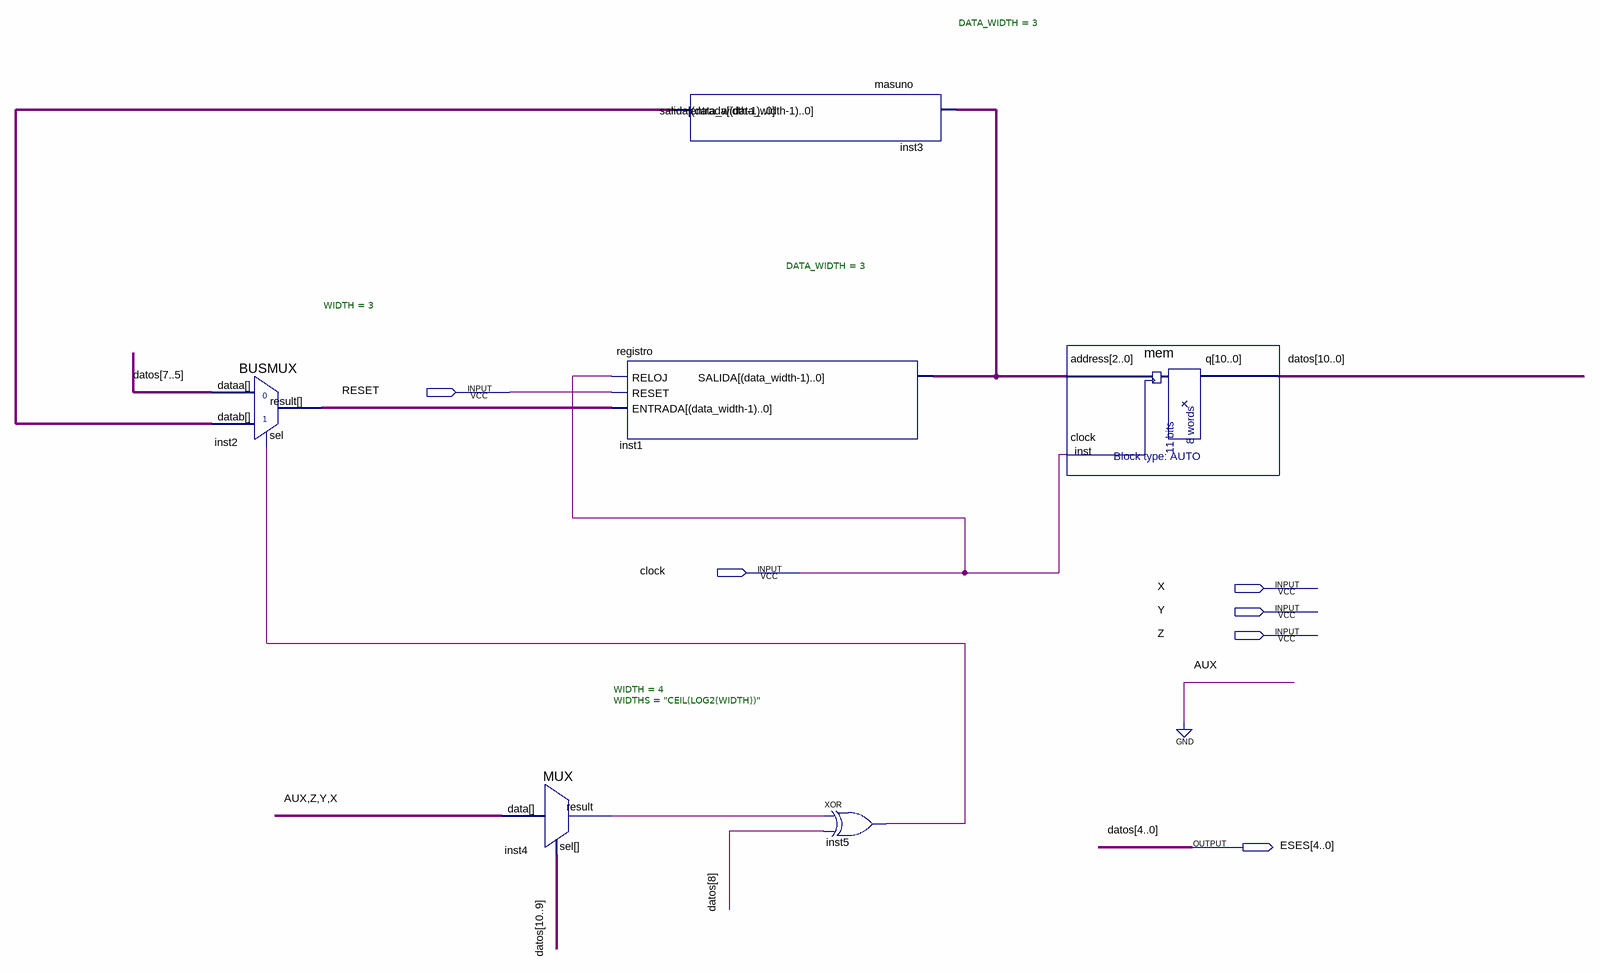
[diagram p0: schematic sheet]
// Quartus schematic implicito.bdf as structural Verilog: 6 symbols, 6 pins
module implicito (
  input  RESET,
  input  clock,
  input  X,
  input  Y,
  input  Z,
  output [4:0] ESES
);

  wire inst4_result, inst5_out;
  wire [2:0] inst1_salida, inst2_result, inst3_salida;
  wire [10:5] datos;

  BUSMUX #(.WIDTH(3)) inst2 (.datab(inst3_salida), .sel(inst5_out), .dataa(datos[7:5]), .result(inst2_result));
  MUX #(.WIDTH(4), .WIDTHS("CEIL(LOG2(WIDTH))")) inst4 (
    .data({1'b0, Z, Y, X}), .sel(datos[10:9]), .result(inst4_result));
  registro #(.DATA_WIDTH(3)) inst1 (.RELOJ(clock), .RESET(RESET), .ENTRADA(inst2_result), .SALIDA(inst1_salida));
  masuno #(.DATA_WIDTH(3)) inst3 (.entrada(inst1_salida), .salida(inst3_salida));
  xor inst5 (inst5_out, inst4_result, datos[8]);
  mem inst (.address(inst1_salida), .clock(clock), .q({datos, ESES}));

  // Other names for the same wires on the sheet: datos[4:0] = ESES
endmodule
